# EAGLE design module (EAGLE 9.5.0)
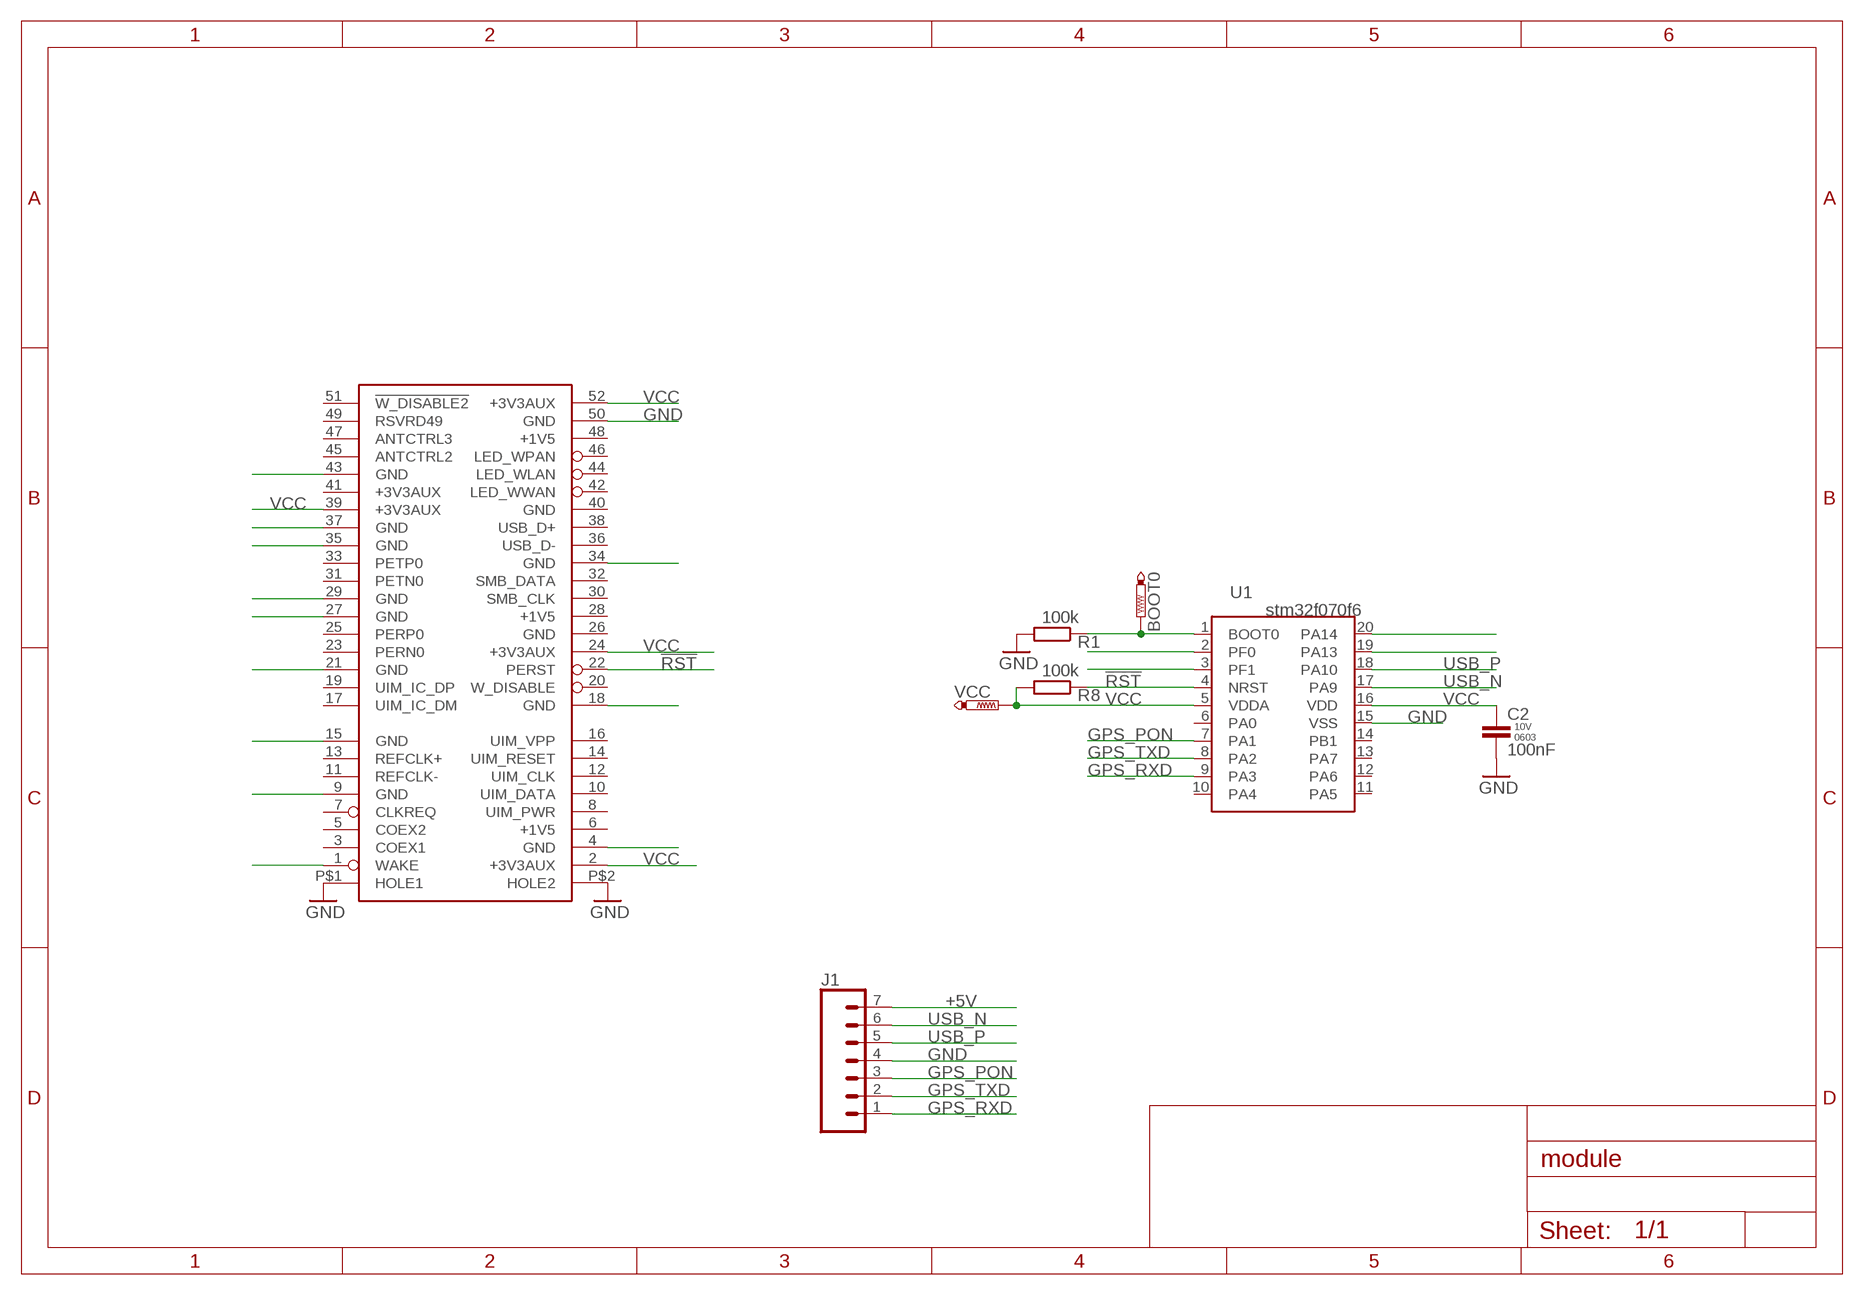
[diagram p0: schematic, sheet 1]

## Parts
BOOT0  PTR1B1,27  [B1,27]
C2  100nF  CAP-0603  [C0603]
FORM1  MPCIE_HALF  [MPCIE_HALF]
J1  CONN_07  [1X07]
R1  100k  RES-0603  [R0603]
R8  100k  RES-0603  [R0603]
U1  STM32F070F6  [SOP65P640X120-20]
VCC  PTR1B1,27  [B1,27]

## Nets
!RST: FORM1.22(PERST) R8.1 U1.4(NRST)
+5V: J1.7
GND: C2.2 FORM1.4(GND) FORM1.9(GND) FORM1.15(GND) FORM1.18(GND) FORM1.21(GND) FORM1.27(GND) FORM1.29(GND) FORM1.34(GND) FORM1.35(GND) FORM1.37(GND) FORM1.43(GND) FORM1.50(GND) FORM1.P$1(HOLE1) FORM1.P$2(HOLE2) J1.4 R1.2 U1.15(VSS)
GPS_PON: J1.3 U1.7(PA1)
GPS_RXD: J1.1 U1.9(PA3)
GPS_TXD: J1.2 U1.8(PA2)
N$2: FORM1.1(WAKE)
N$3: BOOT0.TP R1.1 U1.1(BOOT0)
N$8: U1.2(PF0)
N$9: U1.3(PF1)
N$13: U1.19(PA13)
N$15: U1.20(PA14)
USB_N: J1.6 U1.17(PA9)
USB_P: J1.5 U1.18(PA10)
VCC: C2.1 FORM1.2(+3V3AUX) FORM1.24(+3V3AUX) FORM1.39(+3V3AUX) FORM1.52(+3V3AUX) R8.2 U1.5(VDDA) U1.16(VDD) VCC.TP
Unconnected: FORM1.3(COEX1) FORM1.5(COEX2) FORM1.7(CLKREQ) FORM1.8(UIM_PWR) FORM1.10(UIM_DATA) FORM1.11(REFCLK-) FORM1.12(UIM_CLK) FORM1.13(REFCLK+) FORM1.14(UIM_RESET) FORM1.16(UIM_VPP) FORM1.17(UIM_IC_DM) FORM1.19(UIM_IC_DP) FORM1.20(W_DISABLE) FORM1.23(PERN0) FORM1.25(PERP0) FORM1.30(SMB_CLK) FORM1.31(PETN0) FORM1.33(PETP0) FORM1.36(USB_D-) FORM1.40(GND) FORM1.41(+3V3AUX) FORM1.42(LED_WWAN) FORM1.44(LED_WLAN) FORM1.45(ANTCTRL2) FORM1.46(LED_WPAN) FORM1.47(ANTCTRL3) FORM1.48(+1V5) FORM1.49(RSVRD49) FORM1.51(!W_DISABLE2) U1.6(PA0) U1.10(PA4) U1.11(PA5) U1.12(PA6) U1.13(PA7) U1.14(PB1)

## Power pins joined to a net without a drawn wire
+1V5: FORM1.6(+1V5) FORM1.28(+1V5)
GND: FORM1.26(GND)
SMB_DATA: FORM1.32(SMB_DATA)
USB_D+: FORM1.38(USB_D+)

## Library data of the parts
BOOT0 VCC = testpad:PTR1: TEST PIN
C2 = parts-passives:CAP-; PACKAGE: 0603; RATING: 10V
FORM1 = parts-pci:MPCIE_HALF
J1 = SparkFun-Connectors:CONN_07: Multi connection point. Often used as Generic Header-pin footprint for 0.1 inch spaced/style header connections On any of the 0.1 inch spaced packages, you can populate with these: Break Away Headers - Straight <https://www.sparkfun.com/products/116> (PRT-00116) Break Away Male Headers - Right Angle <https://www.sparkfun.com/products/553> (PRT-00553) Female Headers <https://www.sparkfun.com/products/115> (PRT-00115) Break Away Headers - Machine Pin <https://www.sparkfun.com/products/117> (PRT-00117) Break Away Female Headers - Swiss Machine Pin <https://www.sparkfun.com/products/743> (PRT-00743) For SCREWTERMINALS and SPRING TERMINALS visit here: Screw Terimnals on SparkFun.com <https://www.sparkfun.com/search/results?term=Screw+Terminals> (5mm/3.5mm/2.54mm spacing) This device is also useful as a general connection point to wire up your design to another part of your project. Our various solder wires solder well into these plated through hole pads. Hook-Up Wire - Assortment (Stranded, 22 AWG) <https://www.sparkfun.com/products/11375> (PRT-11375) Hook-Up Wire - Assortment (Solid Core, 22 AWG) <https://www.sparkfun.com/products/11367> (PRT-11367) View the entire wire category on our website here <https://www.sparkfun.com/categories/141> Special notes: Molex polarized connector foot print use with SKU : PRT-08231 with associated crimp pins and housings. 1MM SMD Version SKU: PRT-10208 NOTES ON THE VARIANTS LOCK and LOCK_LONGPADS... This footprint was designed to help hold the alignment of a through-hole component (i.e. 6-pin header) while soldering it into place. You may notice that each hole has been shifted either up or down by 0.005 of an inch from it's more standard position (which is a perfectly straight line). This slight alteration caused the pins (the squares in the middle) to touch the edges of the holes. Because they are alternating, it causes a "brace" to hold the component in place. 0.005 has proven to be the perfect amount of "off-center" position when using our standard breakaway headers. Although looks a little odd when you look at the bare footprint, once you have a header in there, the alteration is very hard to notice. Also,if you push a header all the way into place, it is covered up entirely on the bottom side.
R1 R8 = parts-passives:RES-; PACKAGE: 0603
U1 = parts-st:STM32F070F6

## Board
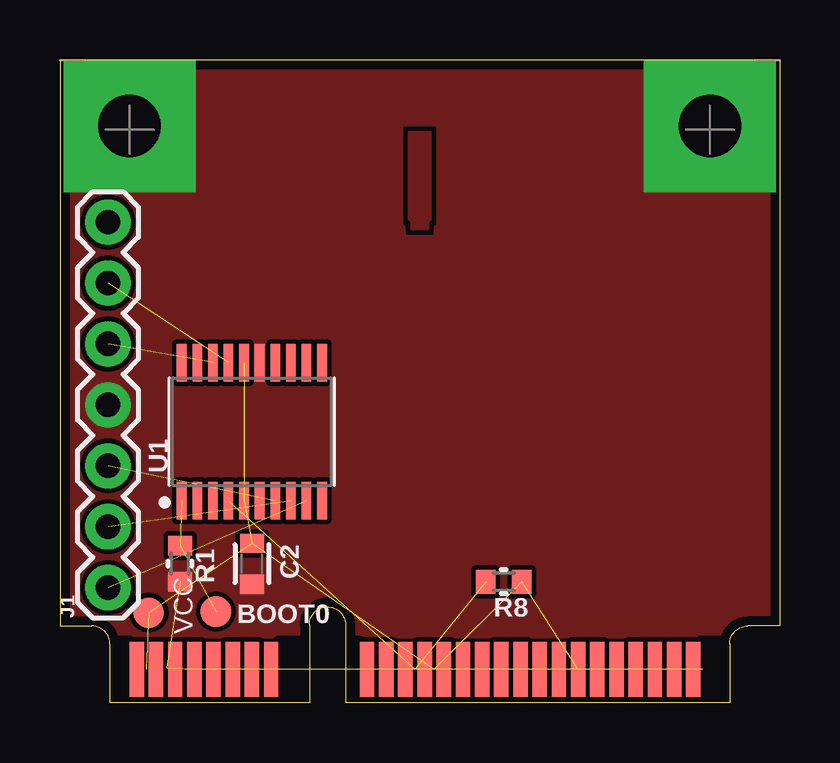
[diagram p1: board, top side]
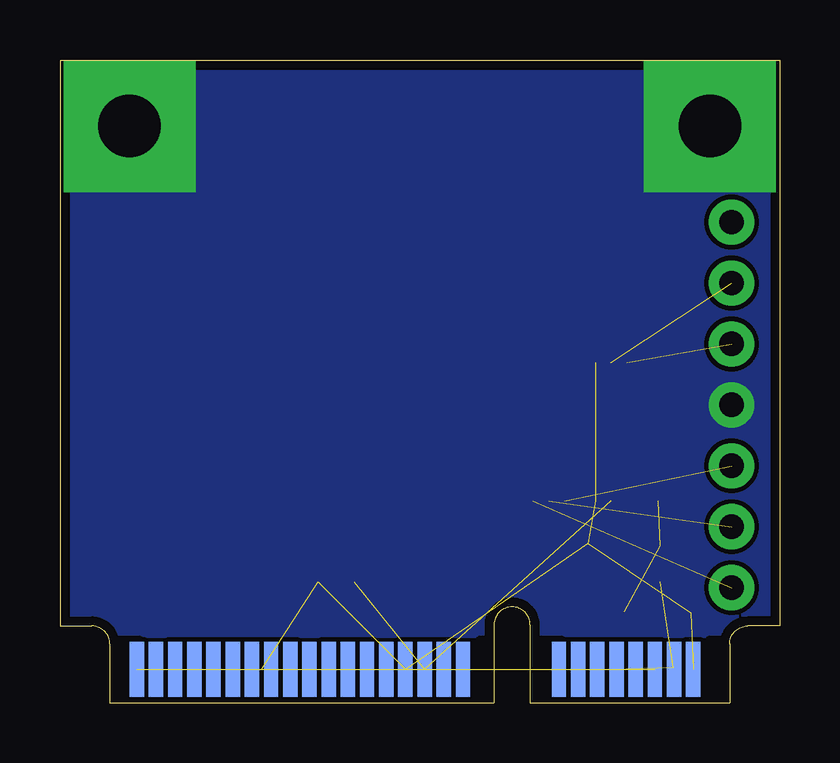
[diagram p2: board, bottom side, seen from below]

Size 30 x 26.8 mm. Coordinates in mm from the lower left corner, seen from the top.
Copper layers (1*16): Top 0.035mm / dielectric 0.9mm / Bottom 0.035mm
Design rules "default *": minimum track width 6mil, minimum drill 0.3mm, track to track 0.2mm, track to pad 0.2mm, pad to pad 0.2mm, via to via 0.2mm, smd to smd 6mil, copper to edge 0.4mm, drill to drill 6mil, minimum pad ring 10mil, minimum via ring 8mil, stop-mask expansion 4mil, vias tented up to drill 0.6mm, thermal gap 10mil

### Footprints (pad centres in the part's own frame; a part is rotated, then mirrored left to right if it is on the bottom)
B1,27 = smd 1.27 x 1.27: TP 0,0
C0603 = smd 0.8 x 1: 1 -0.85,0; 2 0.85,0
MPCIE_HALF = smd 0.6 x 2.3: 1 -11.8,-25.4; 3 -11,-25.4; 5 -10.2,-25.4; 7 -9.4,-25.4; 9 -8.6,-25.4; 11 -7.8,-25.4; 13 -7,-25.4; 15 -6.2,-25.4; 17 -2.2,-25.4; 19 -1.4,-25.4; 21 -0.6,-25.4; 23 0.2,-25.4; 25 1,-25.4; 27 1.8,-25.4; 29 2.6,-25.4; 31 3.4,-25.4; 33 4.2,-25.4; 35 5,-25.4; 37 5.8,-25.4; 39 6.6,-25.4; 41 7.4,-25.4; 43 8.2,-25.4; 45 9,-25.4; 47 9.8,-25.4; 49 10.6,-25.4; 51 11.4,-25.4 | smd 0.6 x 2.3 bottom: 2 -11.4,-25.4; 4 -10.6,-25.4; 6 -9.8,-25.4; 8 -9,-25.4; 10 -8.2,-25.4; 12 -7.4,-25.4; 14 -6.6,-25.4; 16 -5.8,-25.4; 18 -1.8,-25.4; 20 -1,-25.4; 22 -0.2,-25.4; 24 0.6,-25.4; 26 1.4,-25.4; 28 2.2,-25.4; 30 3,-25.4; 32 3.8,-25.4; 34 4.6,-25.4; 36 5.4,-25.4; 38 6.2,-25.4; 40 7,-25.4; 42 7.8,-25.4; 44 8.6,-25.4; 46 9.4,-25.4; 48 10.2,-25.4; 50 11,-25.4; 52 11.8,-25.4 | drill 2.6 pad 5.5 square: P$1 12.1,-2.75; P$2 -12.1,-2.75
1X07 = drill 1.016 pad 1.88: 1 0,0; 2 2.54,0; 3 5.08,0; 4 7.62,0; 5 10.16,0; 6 12.7,0; 7 15.24,0
R0603 = smd 0.8 x 1: 1 -0.75,0; 2 0.75,0
SOP65P640X120-20 = smd 1.559 x 0.407: 1 -2.878,2.925; 2 -2.878,2.275; 3 -2.878,1.625; 4 -2.878,0.975; 5 -2.878,0.325; 6 -2.878,-0.325; 7 -2.878,-0.975; 8 -2.878,-1.625; 9 -2.878,-2.275; 10 -2.878,-2.925; 11 2.878,-2.925; 12 2.878,-2.275; 13 2.878,-1.625; 14 2.878,-0.975; 15 2.878,-0.325; 16 2.878,0.325; 17 2.878,0.975; 18 2.878,1.625; 19 2.878,2.275; 20 2.878,2.925

### Placement (x,y rotation side)
BOOT0  6.5,3.8 0 top
C2  8,5.8 270 top
FORM1  15,26.8 0 top
J1  2,4.8 90 top
R1  5,5.8 270 top
R8  18.5,5.05 0 top
U1  8,11.3 90 top
VCC  3.7,3.75 0 top

### Tracks (layer width: path | path; a pad name or v marks a point on that pad's centre or on a via)
!RST  (2 unrouted)
+1V5  (1 unrouted)
GND  (13 unrouted)
  Bottom 0.4: FORM1.4 4.45,1.45
  Bottom 0.6: FORM1.26 16.4,2
  pour Top (isolate 0.2, rank 6, no thermals): 32,2.8 32,28.8 -2,28.8 -2,2.8
  pour Bottom (isolate 0.2, rank 6, no thermals): -1,27.8 -1,2.8 31,2.8 31,27.8
GPS_PON  (1 unrouted)
GPS_RXD  (1 unrouted)
GPS_TXD  (1 unrouted)
N$3  (2 unrouted)
RF
  pour Top (no thermals): 14.55,23.8 14.55,20.15 14.65,20.05 14.65,19.75 15.35,19.75 15.35,20.05 15.45,20.15 15.45,23.8
USB_N  (1 unrouted)
USB_P  (1 unrouted)
VCC  (8 unrouted)